# EAGLE design SparkFun_XBee3_Cat1_Smart_Modem_USB-C (EAGLE 9.6.2)
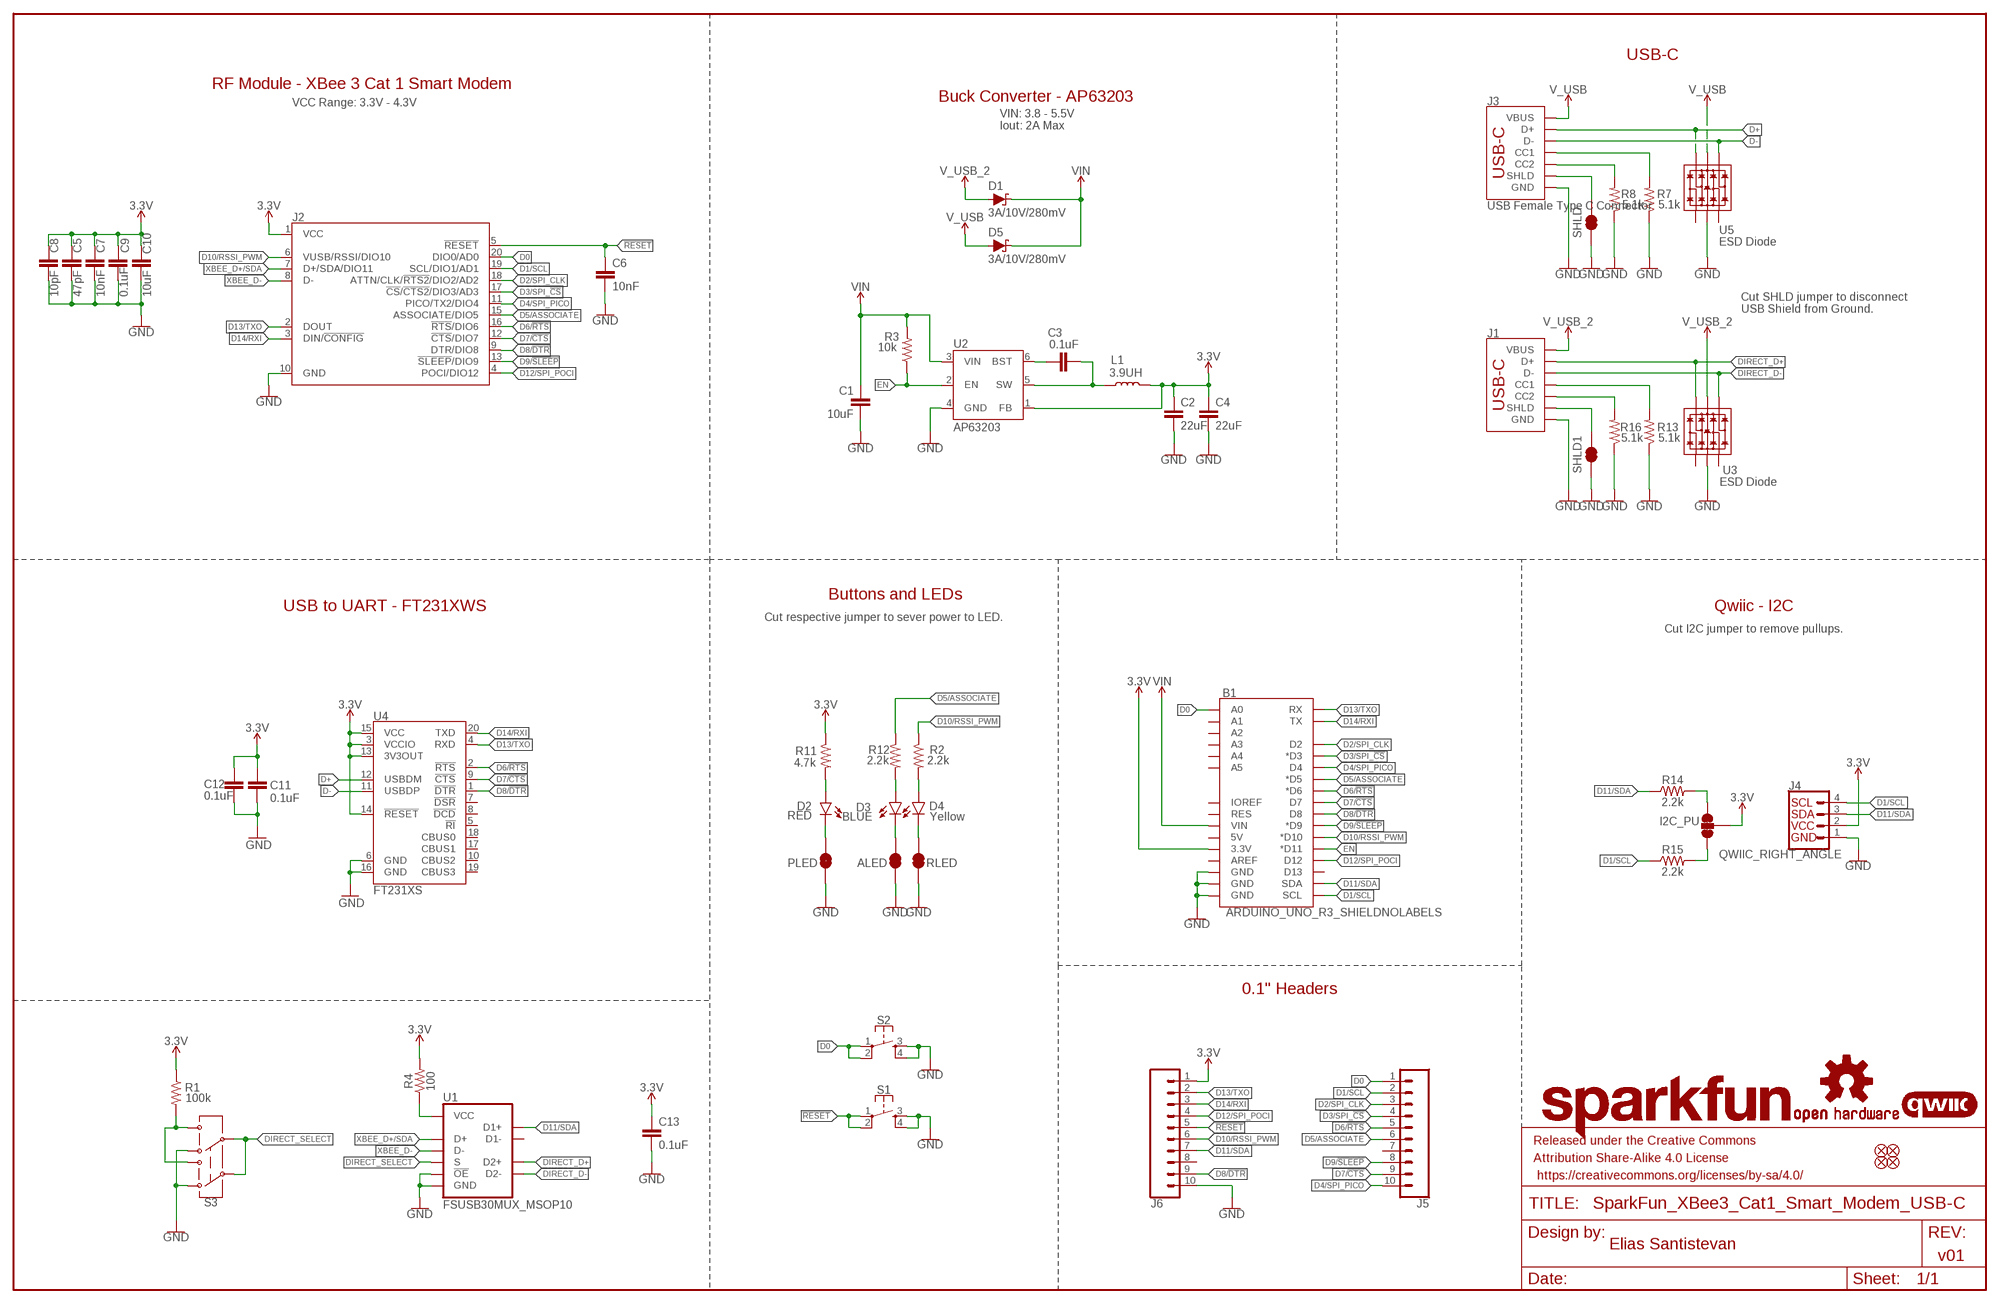
[diagram p0: schematic, sheet 1]

## Parts
ALED  JUMPER-SMT_2_NC_TRACE_SILK  [SMT-JUMPER_2_NC_TRACE_SILK]
B1  ARDUINO_UNO_R3_SHIELDNOLABELS  [UNO_R3_SHIELD_NOLABELS]
C1  10uF  10UF-1210-50V-20%  [1210]
C2  22uF  22UF-0603-6.3V-20%  [0603]
C3  0.1uF  0.1UF-0603-25V-5%  [0603]
C4  22uF  22UF-0603-6.3V-20%  [0603]
C5  47pF  47PF-0603-50V-5%  [0603]
C6  10nF  10NF-0603-50V-10%  [0603]
C7  10nF  10NF-0603-50V-10%  [0603]
C8  10pF  10PF-0603-50V-5%  [0603]
C9  0.1uF  0.1UF-0603-25V-(+80/-20%)  [0603]
C10  10uF  10UF-0603-6.3V-20%  [0603]
C11  0.1uF  0.1UF-0603-25V-(+80/-20%)  [0603]
C12  0.1uF  0.1UF-0603-25V-(+80/-20%)  [0603]
C13  0.1uF  0.1UF-0603-25V-(+80/-20%)  [0603]
D1  3A/10V/280mV  DIODE-SCHOTTKY-BAT60A  [SOD-323]
D2  RED  LED-RED_0603-KB  [LED-0603]
D3  BLUE  LED-BLUE0603  [LED-0603]
D4  Yellow  LED-YELLOW0603  [LED-0603]
D5  3A/10V/280mV  DIODE-SCHOTTKY-BAT60A  [SOD-323]
FD1  FIDUCIAL1X2  [FIDUCIAL-1X2]
FD2  FIDUCIAL1X2  [FIDUCIAL-1X2]
FD3  FIDUCIAL1X2  [FIDUCIAL-1X2]
FD4  FIDUCIAL1X2  [FIDUCIAL-1X2]
FRAME1  FRAME-LEDGER  [CREATIVE_COMMONS]
I2C_PU  JUMPER-SMT_3_2-NC_TRACE_SILK  [SMT-JUMPER_3_2-NC_TRACE_SILK]
J1  USB Female Type C Connector  USB_C_4-LAYER-ISOLATED  [USB-C-16P-4LAYER-ISOLATED]
J2  XBEE_UPDATEXBEE_SMD_SILK  [XBEE3-SMD_SILK]
J3  USB Female Type C Connector  USB_C_4-LAYER-ISOLATED  [USB-C-16P-4LAYER-ISOLATED]
J4  QWIIC_RIGHT_ANGLE  QWIIC_CONNECTORJS-1MM  [JST04_1MM_RA]
J5  CONN_10NO_SILK_PTH_FEMALE  [1X10_NO_SILK]
J6  CONN_10NO_SILK_PTH_FEMALE  [1X10_NO_SILK]
L1  3.9UH  [INDUCTOR_3.9UH]
LOGO1  SFE_LOGO_NAME.1_INCH  [SFE_LOGO_NAME_.1]
LOGO2  OSHW-LOGOS  [OSHW-LOGO-S]
LOGO3  QWIIC_LOGO_3MM  [QWIIC_3MM]
PLED  JUMPER-SMT_2_NC_TRACE_SILK  [SMT-JUMPER_2_NC_TRACE_SILK]
R1  100k  100KOHM-0603-1/10W-1%  [0603]
R2  2.2k  2.2KOHM-0603-1/10W-1%  [0603]
R3  10k  10KOHM-0603-1/10W-1%  [0603]
R4  100  100OHM-0603-1/10W-1%  [0603]
R7  5.1k  5.1KOHM5.1KOHM-0603-1/10W-1%  [0603]
R8  5.1k  5.1KOHM5.1KOHM-0603-1/10W-1%  [0603]
R11  4.7k  4.7KOHM-0603-1/10W-1%  [0603]
R12  2.2k  2.2KOHM-0603-1/10W-1%  [0603]
R13  5.1k  5.1KOHM5.1KOHM-0603-1/10W-1%  [0603]
R14  2.2k  2.2KOHM-0603-1/10W-1%  [0603]
R15  2.2k  2.2KOHM-0603-1/10W-1%  [0603]
R16  5.1k  5.1KOHM5.1KOHM-0603-1/10W-1%  [0603]
RLED  JUMPER-SMT_2_NC_TRACE_SILK  [SMT-JUMPER_2_NC_TRACE_SILK]
S1  MOMENTARY-SWITCH-SPST-2-SMD-5.2MM-TALL  [TACTILE_SWITCH_SMD_5.2MM]
S2  MOMENTARY-SWITCH-SPST-2-SMD-5.2MM-TALL  [TACTILE_SWITCH_SMD_5.2MM]
S3  SWITCH-DPDT-SMD-AYZ0202  [SWITCH_DPDT_SMD_AYZ0202]
SHLD  JUMPER-SMT_2_NC_TRACE_SILK  [SMT-JUMPER_2_NC_TRACE_SILK]
SHLD1  JUMPER-SMT_2_NC_TRACE_SILK  [SMT-JUMPER_2_NC_TRACE_SILK]
U1  FSUSB30MUX_MSOP10  [MSOP10]
U2  AP63203  [SOT23-6]
U3  ESD Diode  TVS_DIODE_ARRAY_DT1042-04SO-7  [SOT-23-6]
U4  FT231XS  [SSOP20_L]
U5  ESD Diode  TVS_DIODE_ARRAY_DT1042-04SO-7  [SOT-23-6]

## Nets
3.3V: B1.3.3V C2.1 C4.1 C5.1 C7.1 C8.1 C9.1 C10.1 C11.1 C12.1 C13.1 I2C_PU.2 J2.1(VCC) J4.2 J6.1 L1.P$2 R1.1 R4.2 R11.1 U2.1(FB) U4.3(VCCIO) U4.13(3V3OUT) U4.14(!RESET) U4.15(VCC)
!RESET!: C6.1 J2.5(!RESET!) J6.5 S1.1 S1.2
D0: B1.A0 J2.20(DIO0/AD0) J5.1 S2.1 S2.2
D1/SCL: B1.SCL J2.19(SCL/DIO1/AD1) J4.4 J5.2 R15.1
D2/SPI_CLK: B1.D2 J2.18(ATTN/CLK/!RTS2!/DIO2/AD2) J5.3
D3/SPI_!CS!: B1.D3(*D3) J2.17(!CS!/!CTS2!/DIO3/AD3) J5.4
D4/SPI_PICO: B1.D4 J2.11(PICO/TX2/DIO4) J5.10
D5/ASSOCIATE: B1.D5(*D5) J2.15(ASSOCIATE/DIO5) J5.6 R12.1
D6/!RTS!: B1.D6(*D6) J2.16(!RTS!/DIO6) J5.5 U4.2(!RTS)
D7/!CTS!: B1.D7 J2.12(!CTS!/DIO7) J5.9 U4.9(!CTS)
D8/!DTR!: B1.D8 J2.9(DTR/DIO8) J6.9 U4.1(!DTR)
D9/!SLEEP!: B1.D9(*D9) J2.13(!SLEEP!/DIO9) J5.8
D10/RSSI_PWM: B1.D10(*D10) J2.6(VUSB/RSSI/DIO10) J6.6 R2.1
D11/SDA: B1.SDA J4.3 J6.7 R14.1 U1.2(D1+)
D12/SPI_POCI: B1.D12 J2.4(POCI/DIO12) J6.4
D13/TXO: B1.RX J2.2(DOUT) J6.2 U4.4(RXD)
D14/RXI: B1.TX J2.3(DIN/!CONFIG!) J6.3 U4.20(TXD)
D+ [Diff pairs]: J3.A6(D+) J3.B6(D+) U4.12(USBDM) U5.6(IO4)
D- [Diff pairs]: J3.A7(D-) J3.B7(D-) U4.11(USBDP) U5.4(IO3)
DIRECT_D+ [Diff pairs]: J1.A6(D+) J1.B6(D+) U1.3(D2+) U3.6(IO4)
DIRECT_D- [Diff pairs]: J1.A7(D-) J1.B7(D-) U1.7(D2-) U3.4(IO3)
DIRECT_SELECT: S3.2 S3.5 U1.1(S)
EN: B1.D11(*D11) R3.1 U2.2(EN)
FIRMWARE: R1.2 S3.1 S3.4
GND: ALED.1 B1.GND@0(GND) B1.GND@1(GND) B1.GND@2(GND) C1.2 C2.2 C4.2 C5.2 C6.2 C7.2 C8.2 C9.2 C10.2 C11.2 C12.2 C13.2 J1.GND J1.GND2(GND) J2.10(GND) J3.GND J3.GND2(GND) J4.1 J6.10 PLED.1 R7.1 R8.1 R13.1 R16.1 RLED.1 S1.3 S1.4 S2.3 S2.4 S3.3 S3.6 SHLD1.1 SHLD.1 U1.5(GND) U1.9(!OE!) U2.4(GND) U3.2(VSS) U4.6(GND) U4.16(GND) U5.2(VSS)
N$1: C3.1 U2.6(BST)
N$2: D4.A R2.2
N$3: D4.C RLED.2
N$5: J3.B5(CC2) R8.2
N$6: J3.A5(CC1) R7.2
N$7: D2.A R11.2
N$8: C3.2 L1.P$1 U2.5(SW)
N$10: R4.1 U1.10(VCC)
N$11: I2C_PU.3 R14.2
N$12: D3.A R12.2
N$13: I2C_PU.1 R15.2
N$14: J1.B5(CC2) R16.2
N$15: J1.A5(CC1) R13.2
N$21: ALED.2 D3.C
N$23: D2.C PLED.2
SHLD: J3.SHLD1(SHLD) J3.SHLD2(SHLD) J3.SHLD3(SHLD) J3.SHLD4(SHLD) J3.SHLD5(SHLD) J3.SHLD6(SHLD) J3.SHLD7(SHLD) J3.SHLD8(SHLD) SHLD.2
SHLD1: J1.SHLD1(SHLD) J1.SHLD2(SHLD) J1.SHLD3(SHLD) J1.SHLD4(SHLD) J1.SHLD5(SHLD) J1.SHLD6(SHLD) J1.SHLD7(SHLD) J1.SHLD8(SHLD) SHLD1.2
V_USB: D5.A J3.VBUS1(VBUS) J3.VBUS2(VBUS) U5.5(VCC)
V_USB_2: D1.A J1.VBUS1(VBUS) J1.VBUS2(VBUS) U3.5(VCC)
VIN: B1.VIN C1.1 D1.C D5.C R3.2 U2.3(VIN)
XBEE_D+/SDA [Diff pairs]: J2.7(D+/SDA/DIO11) U1.4(D+)
XBEE_D- [Diff pairs]: J2.8(D-) U1.6(D-)
Unconnected: B1.5V B1.A1 B1.A2 B1.A3 B1.A4 B1.A5 B1.AREF B1.D13 B1.IOREF B1.RES J5.7 J6.8 U1.8(D1-) U3.1(IO1) U3.3(IO2) U4.5(!RI) U4.7(!DSR) U4.8(!DCD) U4.10(CBUS2) U4.17(CBUS1) U4.18(CBUS0) U4.19(CBUS3) U5.1(IO1) U5.3(IO2)

## Notes on the sheet
- USB-C
- RF Module - XBee 3 Cat 1 Smart Modem
- Buck Converter - AP63203
- VCC Range: 3.3V - 4.3V
- VIN: 3.8 - 5.5V
  Iout: 2A Max
- Cut SHLD jumper to disconnect
  USB Shield from Ground.
- Buttons and LEDs
- USB to UART - FT231XWS | Qwiic - I2C
- Cut respective jumper to sever power to LED.
- Cut I2C jumper to remove pullups.
- 0.1" Headers
- Elias Santistevan
- v01

## Library data of the parts
ALED PLED RLED SHLD SHLD1 = SparkFun-Jumpers:JUMPER-SMT_2_NC_TRACE: Normally closed trace jumper This jumper has a trace between two pads so it's normally closed (NC). Use a razor knife to open the connection. For best results follow the IPC guidelines for cutting traces: Cutout at least 0.063 mm (0.005 in). Remove all loose material to clean up the cut area. Seal the cut with an approved epoxy. Reapply solder to reclose the connection.
B1 = SparkFun-Boards:ARDUINO_UNO_R3_SHIELD: Arduino R3 Shield Footprint Shield form compatible with the Arduino Uno R3. SparkFun Products: MG2639 Cellular Shield <https://www.sparkfun.com/products/13120> MIDI Shield <https://www.sparkfun.com/products/12898> R3 Stackable Headers Kit <https://www.sparkfun.com/products/11417>
C1 = SparkFun-Capacitors:10UF: 10.0µF ceramic capacitors A capacitor is a passive two-terminal electrical component used to store electrical energy temporarily in an electric field.; PROD_ID: CAP-09824
C2 C4 = SparkFun-Capacitors:22UF: 22µF ceramic capacitors A capacitor is a passive two-terminal electrical component used to store electrical energy temporarily in an electric field.; PROD_ID: CAP-14464
C3 = SparkFun-Capacitors:0.1UF: 0.1µF ceramic capacitors A capacitor is a passive two-terminal electrical component used to store electrical energy temporarily in an electric field.; PROD_ID: CAP-08604
C5 = SparkFun-Capacitors:47PF: 47pF ceramic capacitors A capacitor is a passive two-terminal electrical component used to store electrical energy temporarily in an electric field.; PROD_ID: CAP-08913
C6 C7 = SparkFun-Capacitors:10NF: 0.01uF/10nF/10,000pF ceramic capacitors A capacitor is a passive two-terminal electrical component used to store electrical energy temporarily in an electric field. CAP-09321; PROD_ID: CAP-00867
C8 = SparkFun-Capacitors:10PF: 10pF ceramic capacitors A capacitor is a passive two-terminal electrical component used to store electrical energy temporarily in an electric field.; PROD_ID: CAP-11812
C9 C11-C13 = SparkFun-Capacitors:0.1UF: 0.1µF ceramic capacitors A capacitor is a passive two-terminal electrical component used to store electrical energy temporarily in an electric field.; PROD_ID: CAP-00810
C10 = SparkFun-Capacitors:10UF: 10.0µF ceramic capacitors A capacitor is a passive two-terminal electrical component used to store electrical energy temporarily in an electric field.; PROD_ID: CAP-11015
D1 D5 = SparkFun-DiscreteSemi:DIODE-SCHOTTKY: Schottky diode A Schottky diode is a semiconductor diode which has a low forward voltage drop and a very fast switching action.; PROD_ID: DIO-14072
D2 = SparkFun-LED:LED-RED: Red SMD LED Used in manufacturing of most products at SparkFun Packages: 0603 - KB - KingBright (DIO-17976) SMD 0603 package [Datasheet] <https://www.kingbrightusa.com/images/catalog/SPEC/APT1608SURCK.pdf> 0603 - (DIO-00819, has gone EOL) SMD 0603 package 0603 SMART - SMD 0603 SMART package ( more efficient and expensive)[Product Link] <http://www.osram-os.com/Graphics/XPic2/00077099_0.pdf> 1206 - SMD1206 package [Product Link] <https://www.sparkfun.com/datasheets/DevTools/LilyPad/Q150OVS4.pdff> SparkFun Products: Pro Mini 328 -5V <https://www.sparkfun.com/products/821> RedBoard <https://www.sparkfun.com/products/12757> IOIO-OTG <https://www.sparkfun.com/products/13613>; PROD_ID: DIO-17976
D3 = SparkFun-LED:LED-BLUE: Blue SMD LED Used in manufacturing of various products at SparkFun Packages: 0603 - SMD 0603 package [Product Link] <http://www.digikey.com/product-detail/en/SMLE12BC7TT86/511-1589-2-ND/1641808> 1206 - SMD1206 package [Product Link] <http://www.digikey.com/product-detail/en/lite-on-inc/LTST-C150TBKT/160-1643-1-ND/573584> SparkFun Products: ESP8266 Thing-Dev Board <https://www.sparkfun.com/products/13711> RedBoard <https://www.sparkfun.com/products/12757>; PROD_ID: DIO-08575
D4 = SparkFun-LED:LED-YELLOW: Yellow SMD LED Used in manufacturing several products at SparkFun. Packages: 0603 - SMD 0603 package[Product Link] <http://www.kingbrightusa.com/product.asp?catalog_name=LED&product_id=APT1608SYCK> 0603 -SMART - SMART SMD 0603 package (more efficient/more expensive) [Product Link] <http://www.osram-os.com/osram_os/en/products/product-catalog/led-light-emitting-diodes/smartled-0603/ly-l29k/index.jsp> LilyPad - SMD1206 package[Product Datasheet] <https://www.sparkfun.com/datasheets/DevTools/LilyPad/Q150YUS4.pdf> SparkFun Products: Blynk Board <https://www.sparkfun.com/products/13794> IOIO-OTG <https://www.sparkfun.com/products/13613> XBee Explorer Serial <https://www.sparkfun.com/products/13225>; PROD_ID: DIO-09003
FD1-FD4 = SparkFun-Aesthetics:FIDUCIAL: Fiducial Alignment Points Point-of-reference for pick-and-place machines and other optical instruments.
FRAME1 = SparkFun-Aesthetics:FRAME-LEDGER: Schematic Frame - Ledger Standard 11x14 US Ledger frame
I2C_PU = SparkFun-Jumpers:JUMPER-SMT_3_2-NC_TRACE: Normally closed trace jumper (2 of 2 connections) This jumper has a trace between all three pads so they are normally closed (NC). Use a razor knife to open the connection(s). For best results follow the IPC guidelines for cutting traces: Cutout at least 0.063 mm (0.005 in). Remove all loose material to clean up the cut area. Seal the cut with an approved epoxy. Reapply solder to reclose the connection(s).
J1 J3 = SparkFun-Connectors:USB_C: USB Type C 16Pin Connector Super Speed pins not available on the 16-pin purely SMD connector so this part is best for USB 2.0 implementations. D1 and D2 are tied together enabling D+/- no matter which way the cable is plugged into the connector. The two channel configuration pins (CC1/2) are exposed. These are normally connected to ground via 5.1k resistors but can be reconfigured for high current/high power applications. **4-LAYER BOARD WARNING!!** If designing 4-layer board, make sure to select the variant _4-LAYER-ISOLATED. The linked footprint (USB-C-16-4LAYER-ISOLATED) includes some very necessary cutout polygons in the inner layers (2 and 15). This prevents the PTH mounting shield legs on the USB connector from electrically connecting any other polygons on the inner layers (usually VCC and GND).; PROD_ID: CONN-14122
J2 = xbee_smart_modem:XBEE_UPDATE: XBee 3 Cat 1 Smart Modem; PROD_ID: WRL-17581
J4 = SparkFun-Connectors:QWIIC_CONNECTOR: SparkFun I2C Standard Qwiic Connector An SMD 1mm pitch JST connector makes it easy and quick (get it? Qwiic?) to connect I2C devices to each other. The Qwiic system <http://www.sparkfun.com/qwiic> enables fast and solderless connection between popular platforms and various sensors and actuators. We carry 200mm <https://www.sparkfun.com/products/14204>, 100mm <https://www.sparkfun.com/products/14205>, 50mm <https://www.sparkfun.com/products/14206>, and breadboard friendly <https://www.sparkfun.com/products/14207> Qwiic cables. We also offer 10 pcs strips <https://www.sparkfun.com/products/14323> the SMD connectors.; PROD_ID: CONN-13694
J5 J6 = SparkFun-Connectors:CONN_10: Multi connection point. Often used as Generic Header-pin footprint for 0.1 inch spaced/style header connections On any of the 0.1 inch spaced packages, you can populate with these: Break Away Headers - Straight <https://www.sparkfun.com/products/116> (PRT-00116) Break Away Male Headers - Right Angle <https://www.sparkfun.com/products/553> (PRT-00553) Female Headers <https://www.sparkfun.com/products/115> (PRT-00115) Break Away Headers - Machine Pin <https://www.sparkfun.com/products/117> (PRT-00117) Break Away Female Headers - Swiss Machine Pin <https://www.sparkfun.com/products/743> (PRT-00743) Arduino Stackable Header - 10 Pin <https://www.sparkfun.com/products/11376> (PRT-11376) For SCREWTERMINALS and SPRING TERMINALS visit here: Screw Terimnals on SparkFun.com <https://www.sparkfun.com/search/results?term=Screw+Terminals> (5mm/3.5mm/2.54mm spacing) This device is also useful as a general connection point to wire up your design to another part of your project. Our various solder wires solder well into these plated through hole pads. Hook-Up Wire - Assortment (Stranded, 22 AWG) <https://www.sparkfun.com/products/11375> (PRT-11375) Hook-Up Wire - Assortment (Solid Core, 22 AWG) <https://www.sparkfun.com/products/11367> (PRT-11367) View the entire wire category on our website here <https://www.sparkfun.com/categories/141> Special notes: Molex polarized connector foot print use with SKU : PRT-08231 with associated crimp pins and housings. 1MM SMD Version SKU: PRT-10208 NOTES ON THE VARIANTS LOCK and LOCK_LONGPADS... This footprint was designed to help hold the alignment of a through-hole component (i.e. 6-pin header) while soldering it into place. You may notice that each hole has been shifted either up or down by 0.005 of an inch from it's more standard position (which is a perfectly straight line). This slight alteration caused the pins (the squares in the middle) to touch the edges of the holes. Because they are alternating, it causes a "brace" to hold the component in place. 0.005 has proven to be the perfect amount of "off-center" position when using our standard breakaway headers. Although looks a little odd when you look at the bare footprint, once you have a header in there, the alteration is very hard to notice. Also,if you push a header all the way into place, it is covered up entirely on the bottom side.
L1 = SparkFun-Coils:3.9UH: Würth's Electronik 3.9uH Inductor Characteristics 3.9uH 2.4A Current Rating 2.8A Saturation Inductance Frequency: 100kHzd AEC-Q200 Certified 5mm x 5mm Package 30% tolerance; PROD_ID: NDUC-18014
LOGO1 = SparkFun-Aesthetics:SFE_LOGO_NAME: SparkFun Font Logo This is the SparkFun name logo. The logo on the schematic will always be the same size; the package variant is the height of the flame part of the logo (or the height the flame would be, if it were drawn). Default layer for the logo on the board is tSilk.
LOGO2 = SparkFun-Aesthetics:OSHW-LOGO: Open-Source Hardware (OSHW) Logo This logo indicates the piece of hardware it is found on incorporates a OSHW license and/or adheres to the definition of open source hardware found here: http://freedomdefined.org/OSHW
LOGO3 = SparkFun-Aesthetics:QWIIC_LOGO: Qwiic Logos for placement on schematic and PCB. The 5.5mm silk logo is best for placing next to Qwiic connector.
R1 = SparkFun-Resistors:100KOHM: 100kΩ resistor A resistor is a passive two-terminal electrical component that implements electrical resistance as a circuit element. Resistors act to reduce current flow, and, at the same time, act to lower voltage levels within circuits. - Wikipedia; PROD_ID: RES-07828
R2 R12 R14 R15 = SparkFun-Resistors:2.2KOHM: 2.2kΩ resistor A resistor is a passive two-terminal electrical component that implements electrical resistance as a circuit element. Resistors act to reduce current flow, and, at the same time, act to lower voltage levels within circuits. - Wikipedia; PROD_ID: RES-08272
R3 = SparkFun-Resistors:10KOHM: 10kΩ resistor A resistor is a passive two-terminal electrical component that implements electrical resistance as a circuit element. Resistors act to reduce current flow, and, at the same time, act to lower voltage levels within circuits. - Wikipedia; PROD_ID: RES-00824
R4 = SparkFun-Resistors:100OHM: 100Ω resistor A resistor is a passive two-terminal electrical component that implements electrical resistance as a circuit element. Resistors act to reduce current flow, and, at the same time, act to lower voltage levels within circuits. - Wikipedia; PROD_ID: RES-07863
R7 R8 R13 R16 = SparkFun-Resistors:5.1KOHM; PROD_ID: RES-12083
R11 = SparkFun-Resistors:4.7KOHM: 4.7kΩ resistor A resistor is a passive two-terminal electrical component that implements electrical resistance as a circuit element. Resistors act to reduce current flow, and, at the same time, act to lower voltage levels within circuits. - Wikipedia; PROD_ID: RES-07857
S1 S2 = SparkFun-Switches:MOMENTARY-SWITCH-SPST-2: Momentary Switch (Pushbutton) - SPST - Two Circuits Normally-open (NO) SPST momentary switches (buttons, pushbuttons). Schematic symbol includes two switch circuits. Variants SMD-4.6MMX2.8MM - 4.60mm x 2.80mm Tactile Momentary Button Switch - Used on SparkFun Pro Micro - RP2040 <https://www.sparkfun.com/products/17717> SMD-5.2MM - Mini Pushbutton Switch - SMD <https://www.sparkfun.com/products/8720> - Used on Arduino Pro Mini <https://www.sparkfun.com/products/11114>; PROD_ID: SWCH-14139
S3 = SparkFun-Switches:SWITCH-DPDT: Double-Pole, Double-Throw (DPDT) Switch Double-pole, double-throw switches. Variant Overview PTH-GPI-152-3013 Used on SparkFun Geiger Counter <https://www.sparkfun.com/products/11345> SMD-AY0202 Surface Mount DPDT Switch <https://www.sparkfun.com/products/597> (COM-00597) Used on e.g. LilyPad Arduino USB - ATmega32U4 Board <https://www.sparkfun.com/products/12049>; PROD_ID: SWCH-08179; SF_SKU: COM-00597
U1 = SparkFun-IC-Special-Function:FSUSB30MUX; PROD_ID: IC-15569
U2 = SparkFun-IC-Power:AP63203: Diodes Inc. AP63203 3.8V-32V input 3.3V Buck The AP63200/AP63201/AP63203/AP63205 is a 2A, synchronous buck converter with a wide input voltage range of 3.8V to 32V and fully integrates a 125mΩ high-side power MOSFET and a 68mΩ lowside power MOSFET to provide high-efficiency step-down DC/DC conversion; PROD_ID: VREG-15244
U3 U5 = SparkFun-DiscreteSemi:TVS_DIODE_ARRAY; PROD_ID: IC-13538
U4 = SparkFun-IC-Comms:FT231X: FTDI FT231X Full Speed USB to Full-handshake UART This USB2.0 Full Speed IC offers a compact bridge to full handshake UART interfaces. The device is a UART, capable of operating up to 3MBaud, with low power consumption (8mA). The FT231X includes the complete FT-X series feature set and enables USB to be added into a system design quickly and easily over a UART interface. Datasheet <http://cdn.sparkfun.com/datasheets/Components/General%20IC/DS_FT231X.pdf> SparkFun Products SparkFun RedBoard - Programmed with Arduino <https://www.sparkfun.com/products/12757> (DEV-12757) SparkFun XBee Explorer USB <https://www.sparkfun.com/products/11812> (WRL-11812) SparkFun XBee Explorer Dongle <https://www.sparkfun.com/products/11697> (WRL-11697) SparkFun Blynk Board - ESP8266 <https://www.sparkfun.com/products/13794> (WRL-13794) SparkFun ESP8266 Thing - Dev Board <https://www.sparkfun.com/products/13711> (WRL-13711) SparkFun Block for Intel® Edison - Base <https://www.sparkfun.com/products/13045> (DEV-13045) SparkFun RedStick <https://www.sparkfun.com/products/13741> (DEV-13741) SparkFun Beefy 3 - FTDI Basic Breakout <https://www.sparkfun.com/products/13746> (DEV-13746) SparkFun FT231X Breakout <https://www.sparkfun.com/products/11736> (BOB-11736); PROD_ID: IC-11524

## Net classes
1 POWER: width 0.559 mm, drill 0.305 mm
2 Diff pairs: width 0.203 mm, drill 0.305 mm, clearance 0.152 mm

## Board
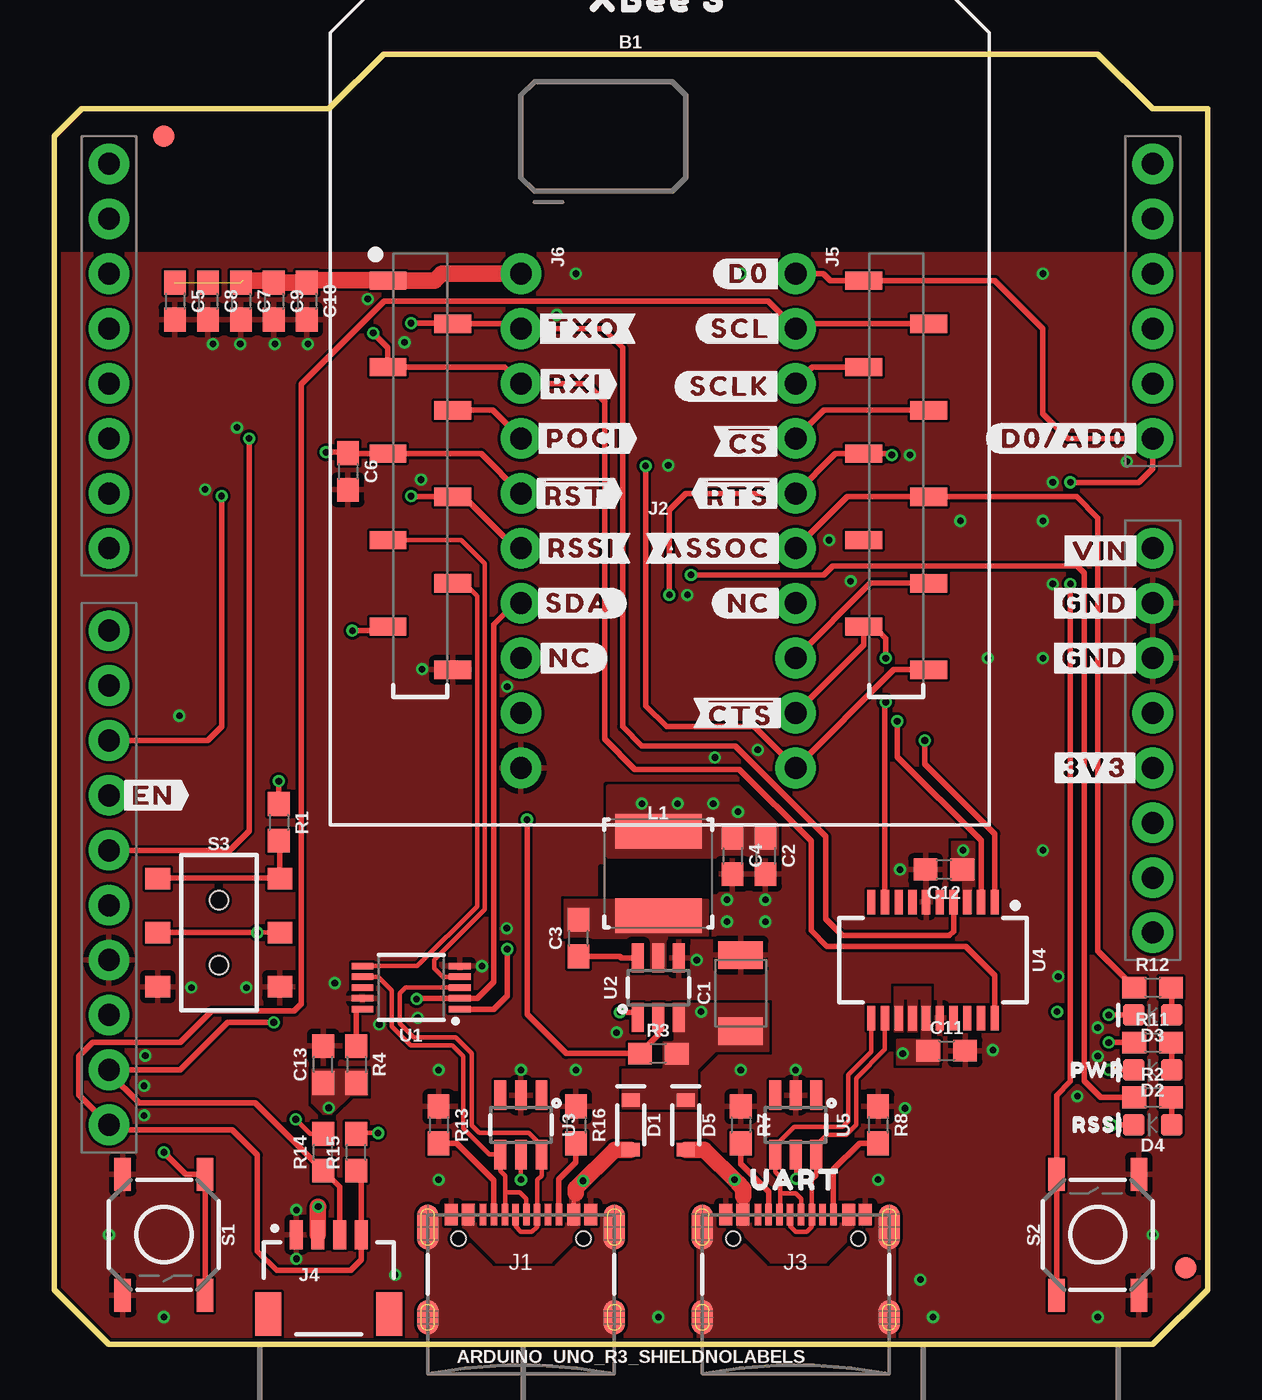
[diagram p1: board, top side]
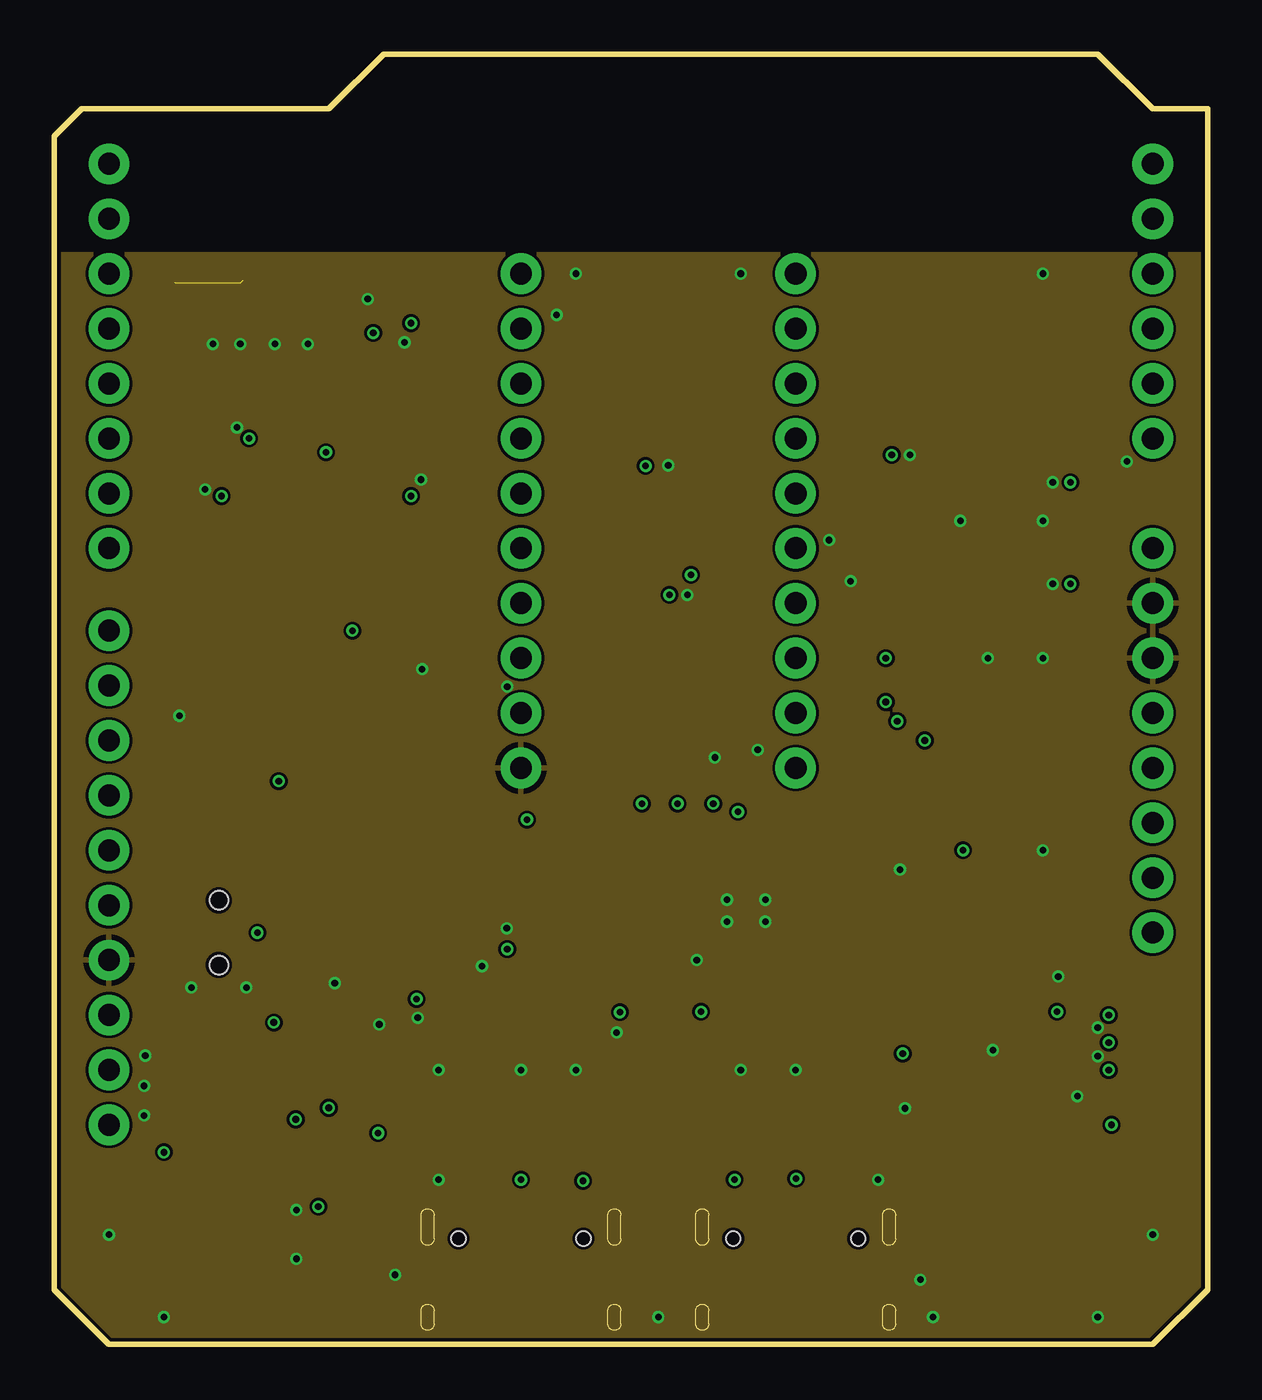
[diagram p2: board, inner layer Route2]
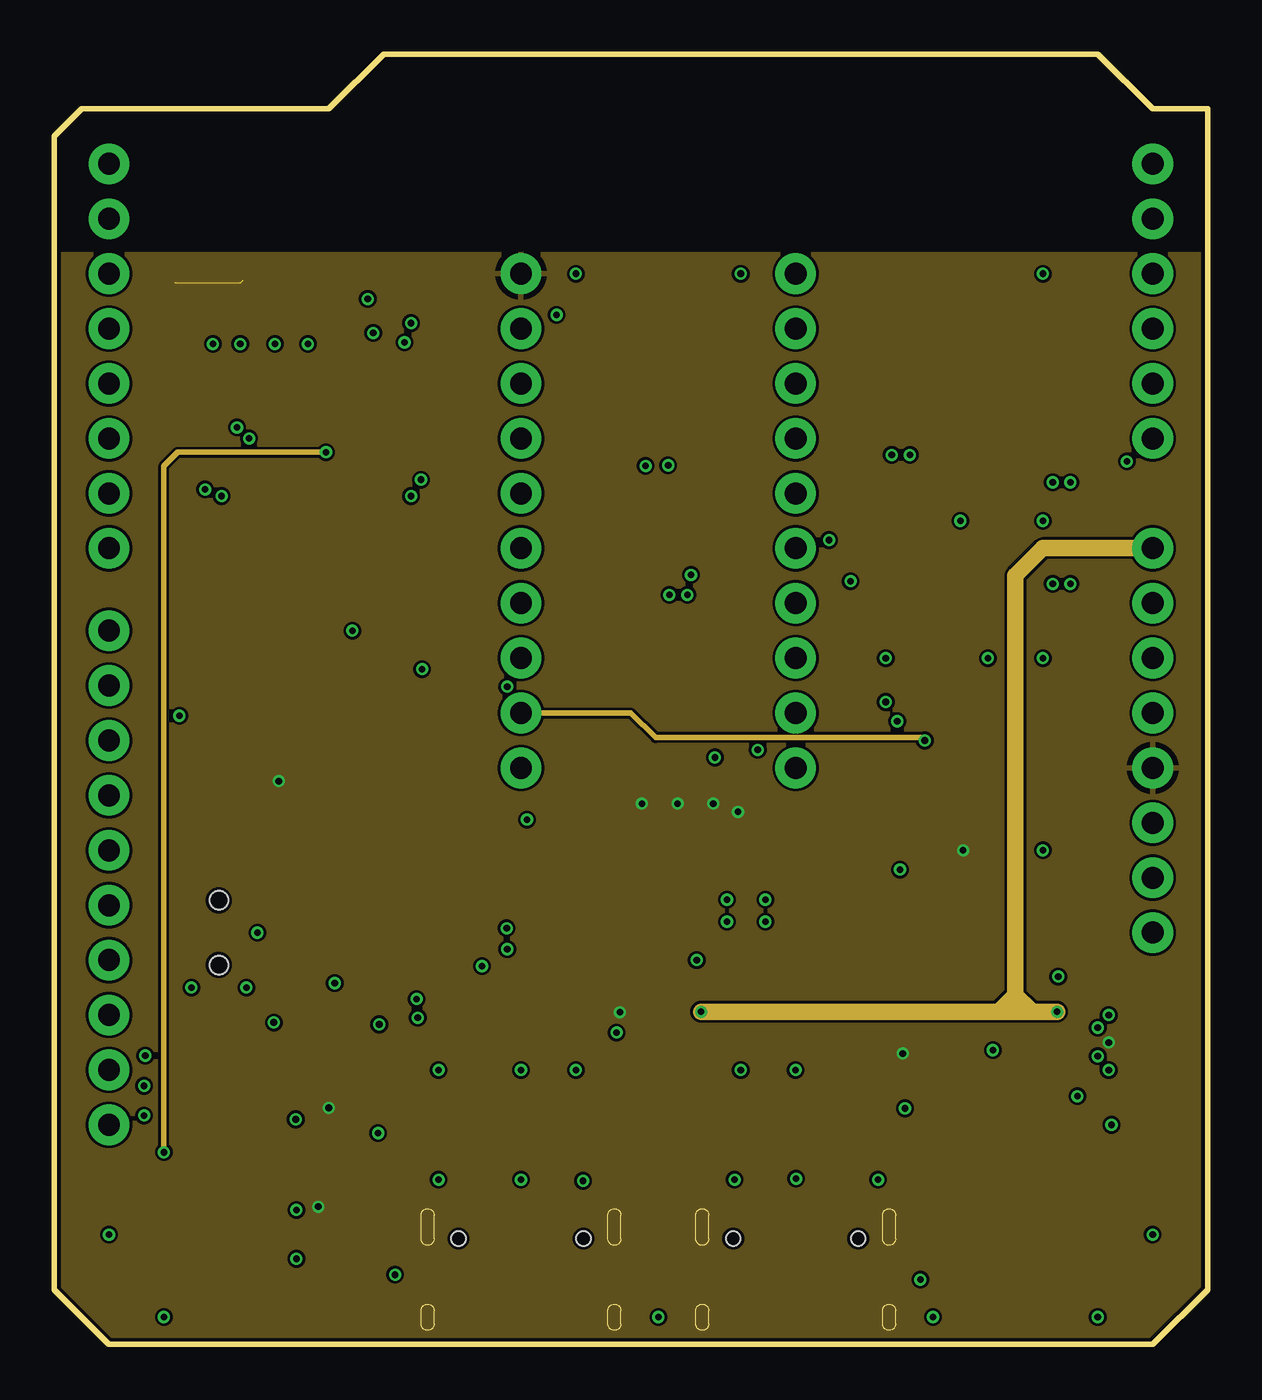
[diagram p3: board, inner layer Route15]
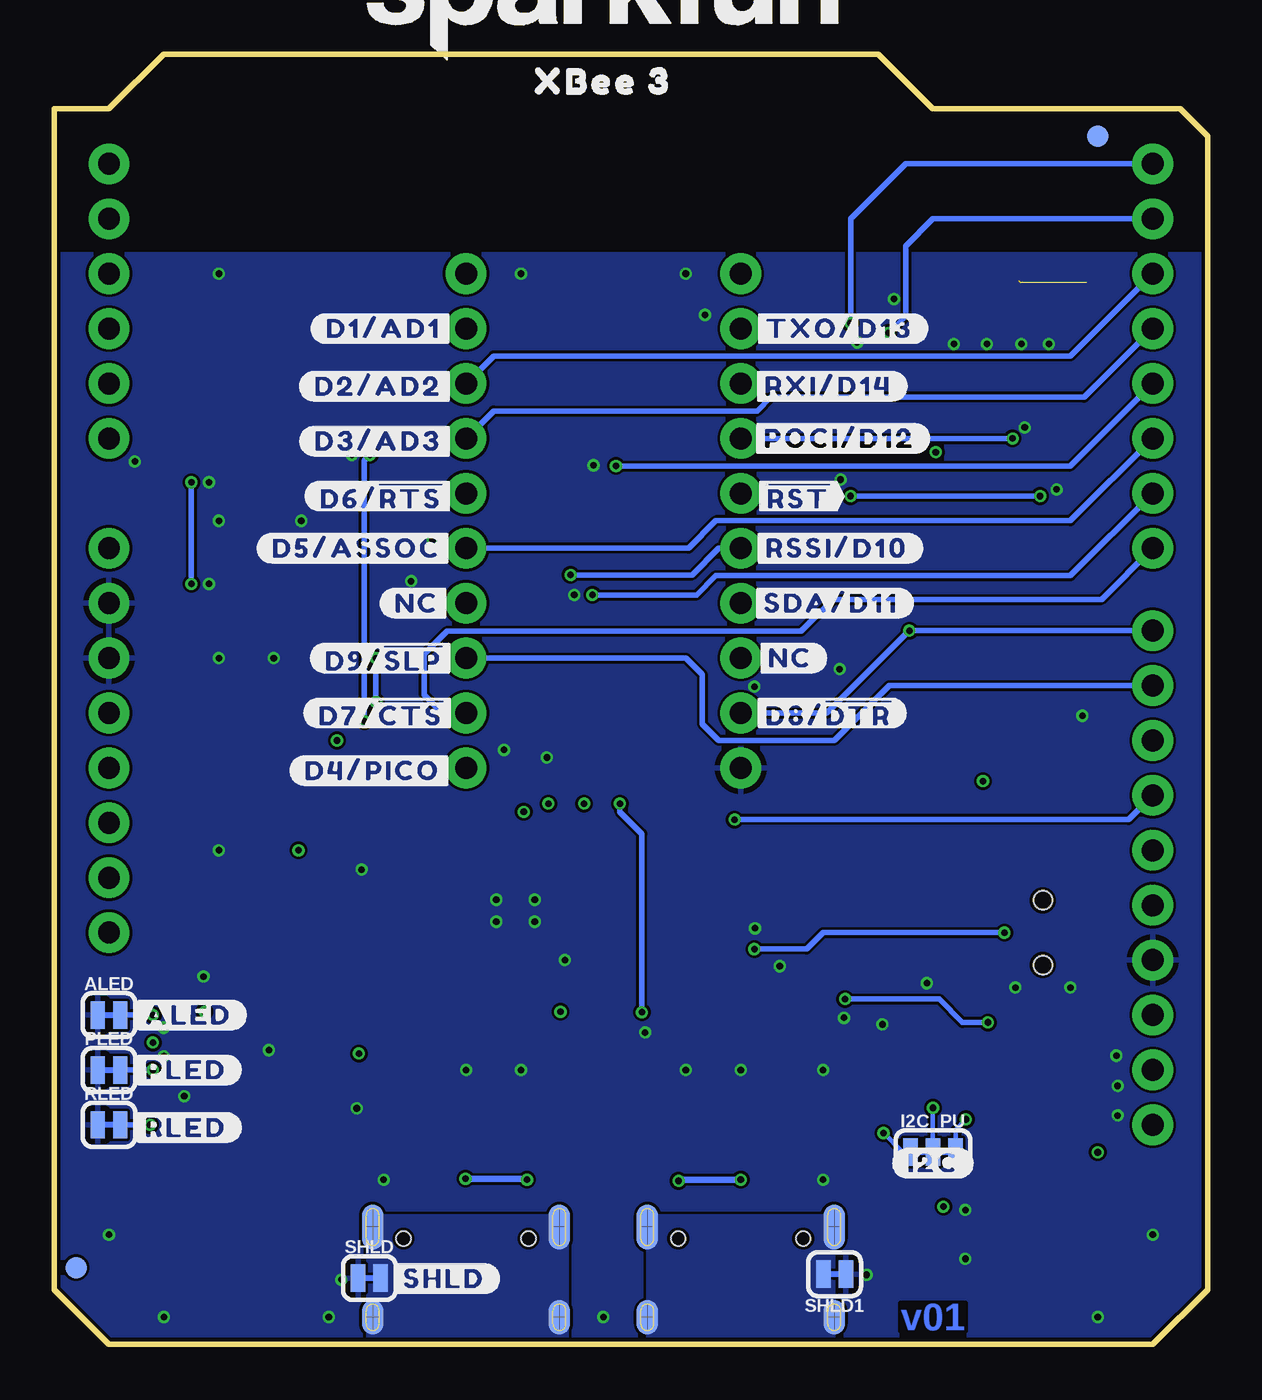
[diagram p4: board, bottom side, seen from below]

Size 53.34 x 59.69 mm. Coordinates in mm from the lower left corner, seen from the top.
Outline: 0,55.88 0,2.54 2.54,0 50.8,0 53.34,2.54 53.34,57.15 50.8,57.15 48.26,59.69 15.24,59.69 12.7,57.15 1.27,57.15 0,55.88
Copper layers (1*2*15*16): Top 0.035559375mm / dielectric 0.47751875mm / Route2 0.035559375mm / dielectric 0.47751875mm / Route15 0.035559375mm / dielectric 0.47751875mm / Bottom 0.035559375mm
Design rules "SparkFun-4-Layer-Minimum-JLCPCB": minimum track width 5mil, minimum drill 0.2mm, track to track 5mil, track to pad 5mil, pad to pad 5mil, via to via 5mil, smd to smd 5mil, copper to edge 7mil, drill to drill 7mil, minimum pad ring 5mil, minimum via ring 5mil, stop-mask expansion 2.5mil, vias tented up to drill 25mil, thermal gap 10mil
tRestrict: area 30.2,21 to 30.6,22.1; area 25.3,21 to 25.7,22.1

### Footprints (pad centres in the part's own frame; a part is rotated, then mirrored left to right if it is on the bottom)
SMT-JUMPER_2_NC_TRACE_SILK = smd 0.66 x 1.27: 1 -0.521,0; 2 0.521,0
UNO_R3_SHIELD_NOLABELS = drill 1.016 pad 1.88: 3.3V 24.13,-3.81; 5V 24.13,-1.27; A0 24.13,11.43; A1 24.13,13.97; A2 24.13,16.51; A3 24.13,19.05; A4 24.13,21.59; A5 24.13,24.13; AREF -24.13,-15.24; D2 -24.13,19.05; D3 -24.13,16.51; D4 -24.13,13.97; D5 -24.13,11.43; D6 -24.13,8.89; D7 -24.13,6.35; D8 -24.13,2.54; D9 -24.13,0; D10 -24.13,-2.54; D11 -24.13,-5.08; D12 -24.13,-7.62; D13 -24.13,-10.16; GND@0 24.13,1.27; GND@1 24.13,3.81; GND@2 -24.13,-12.7; IOREF 24.13,-8.89; NC 24.13,-11.43; RES 24.13,-6.35; RX -24.13,24.13; SCL -24.13,-20.32; SDA -24.13,-17.78; TX -24.13,21.59; VIN 24.13,6.35
1210 = smd 1.27 x 2.06: 1 -1.755,0; 2 1.755,0
0603 = smd 1.1 x 1: 1 -0.85,0; 2 0.85,0
SOD-323 = smd 0.63 x 0.83: A 1.15,0; C -1.15,0
LED-0603 = smd 1 x 1: A -0.877,0; C 0.877,0
FIDUCIAL-1X2 = smd 1 x 1: 1 0,0
SMT-JUMPER_3_2-NC_TRACE_SILK = smd 0.66 x 1.27: 1 -1.041,0; 2 0,0; 3 1.041,0
USB-C-16P-4LAYER-ISOLATED = smd 0.3 x 1: A5 -1.25,-0.34; A6 -0.25,-0.34; A7 0.25,-0.34; A8 1.25,-0.34; B5 1.75,-0.34; B6 0.75,-0.34; B7 -0.75,-0.34; B8 -1.75,-0.34 | smd 0.6 x 1: GND -3.225,-0.34; GND2 3.225,-0.34; VBUS1 -2.45,-0.34; VBUS2 2.45,-0.34 | smd 1 x 2.1: SHLD1 -4.32,-0.915; SHLD2 4.32,-0.915 | smd 1 x 2.1 bottom: SHLD3 -4.32,-0.915; SHLD4 4.32,-0.915 | smd 1 x 1.6: SHLD5 -4.32,-5.095; SHLD8 4.32,-5.095 | smd 1 x 1.6 bottom: SHLD6 -4.32,-5.095; SHLD7 4.32,-5.095 | hole 0.65: -2.89,-1.445; 2.89,-1.445
XBEE3-SMD_SILK = smd 1.7 x 0.85: 1 -12.5,11.11; 2 -9.5,9.11; 3 -12.5,7.11; 4 -9.5,5.11; 5 -12.5,3.11; 6 -9.5,1.11; 7 -12.5,-0.89; 8 -9.5,-2.89; 9 -12.5,-4.89; 10 -9.5,-6.89; 11 12.5,-6.89; 12 9.5,-4.89; 13 12.5,-2.89; 14 9.5,-0.89; 15 12.5,1.11; 16 9.5,3.11; 17 12.5,5.11; 18 9.5,7.11; 19 12.5,9.11; 20 9.5,11.11
JST04_1MM_RA = smd 0.6 x 1.35: 1 -1.5,0; 2 -0.5,0; 3 0.5,0; 4 1.5,0 | smd 1.2 x 2: NC1 2.8,-3.675; NC2 -2.8,-3.675
1X10_NO_SILK = drill 1.016 pad 1.88: 1 0,0; 2 2.54,0; 3 5.08,0; 4 7.62,0; 5 10.16,0; 6 12.7,0; 7 15.24,0; 8 17.78,0; 9 20.32,0; 10 22.86,0
INDUCTOR_3.9UH = smd 4 x 1.6: P$1 0,-2; P$2 0,1.9
TACTILE_SWITCH_SMD_5.2MM = smd 1.524 x 0.762: 1 -2.794,1.905; 2 2.794,1.905; 3 -2.794,-1.905; 4 2.794,-1.905
SWITCH_DPDT_SMD_AYZ0202 = smd 1 x 1.15: 1 -2.5,2.825; 2 0,2.825; 3 2.5,2.825; 4 -2.5,-2.825; 5 0,-2.825; 6 2.5,-2.825 | hole 0.85: 1.5,0; -1.5,0
MSOP10 = smd 1 x 0.3: 1 -2.25,1; 2 -2.25,0.5; 3 -2.25,0; 4 -2.25,-0.5; 5 -2.25,-1; 6 2.25,-1; 7 2.25,-0.5; 8 2.25,0; 9 2.25,0.5; 10 2.25,1
SOT23-6 = smd 0.55 x 1.35: 1 -0.95,-1.375; 2 0,-1.375; 3 0.95,-1.375; 4 0.95,1.375; 5 0,1.375; 6 -0.95,1.375
SOT-23-6 = smd 0.55 x 1.35: 1 -0.95,-1.375; 2 0,-1.375; 3 0.95,-1.375; 4 0.95,1.375; 5 0,1.375; 6 -0.95,1.375
SSOP20_L = smd 0.381 x 1.143: 1 -2.857,-2.68; 2 -2.223,-2.68; 3 -1.587,-2.68; 4 -0.953,-2.68; 5 -0.318,-2.68; 6 0.318,-2.68; 7 0.953,-2.68; 8 1.587,-2.68; 9 2.223,-2.68; 10 2.857,-2.68; 11 2.857,2.68; 12 2.223,2.68; 13 1.587,2.68; 14 0.953,2.68; 15 0.318,2.68; 16 -0.318,2.68; 17 -0.953,2.68; 18 -1.587,2.68; 19 -2.223,2.68; 20 -2.857,2.68

### Placement (x,y rotation side)
ALED  50.8,15.24 0 bottom
B1  26.67,30.48 0 top
C1  31.75,16.26 90 top
C2  32.89,22.61 270 top
C3  24.26,18.8 90 top
C4  31.37,22.61 270 top
C5  5.59,48.26 270 top
C6  13.59,40.39 270 top
C7  8.64,48.26 270 top
C8  7.11,48.26 270 top
C9  10.16,48.26 270 top
C10  11.68,48.26 270 top
C11  41.27,13.59 0 top
C12  41.15,21.97 180 top
C13  12.45,12.95 90 top
D1  26.67,10.16 270 top
D2  50.8,12.7 180 top
D3  50.8,15.24 180 top
D4  50.8,10.16 180 top
D5  29.21,10.16 270 top
FD1  5.08,55.88 0 top
FD2  5.08,55.88 0 bottom
FD3  52.32,3.56 0 top
FD4  52.32,3.56 0 bottom
FRAME1  -10.16,-36.83 0 top  (outside the outline)
I2C_PU  12.7,8.89 0 bottom
J1  21.59,6.35 0 top
J2  27.94,38.1 0 top
J3  34.29,6.35 0 top
J4  12.7,5.08 0 top
J5  34.29,49.53 270 top
J6  21.59,49.53 270 top
L1  27.94,21.84 0 top
LOGO1  27.56,64.26 0 top  (outside the outline)
LOGO2  67.56,20.07 0 top  (outside the outline)
LOGO3  71.5,19.76 90 top  (outside the outline)
PLED  50.8,12.7 0 bottom
R1  10.39,24.16 270 top
R2  50.8,11.43 0 top
R3  27.94,13.46 0 top
R4  13.97,12.95 270 top
R7  31.75,10.16 270 top
R8  38.1,10.16 270 top
R11  50.8,13.97 0 top
R12  50.8,16.51 0 top
R13  17.78,10.16 270 top
R14  12.45,8.89 90 top
R15  13.97,8.89 90 top
R16  24.13,10.16 270 top
RLED  50.8,10.16 0 bottom
S1  5.08,5.08 270 top
S2  48.26,5.08 90 top
S3  7.62,19.05 270 top
SHLD  38.76,3.07 0 bottom
SHLD1  17.25,3.25 180 bottom
U1  16.51,16.51 180 top
U2  27.94,16.51 0 top
U3  21.59,10.16 180 top
U4  40.64,17.78 180 top
U5  34.29,10.16 180 top
U$1  [RSSI31]  48.26,10.16 0 top
U$2  [PWR29]  48.26,12.7 0 top
U$4  [#SHLD#36]  35.31,3.05 0 bottom
U$5  [#NC#1]  19.3,31.75 0 bottom
U$6  [#D3#AD3#23]  38.35,41.78 0 bottom
U$7  [#NC#3]  36.58,34.29 0 bottom
U$8  [#D0#AD0#18]  46.74,41.91 0 top
U$9  [#NC#1]  23.88,31.75 0 top
U$10  [#NC#3]  32.13,34.29 0 top
U$11  [#D1#AD1#8]  38.1,46.99 0 bottom
U$12  [#GND#0]  48.13,31.75 0 top
U$13  [#D8##DTR##27]  17.53,29.21 0 bottom
U$14  [#RSSI#D10#17]  17.14,36.83 0 bottom
U$15  [#SDA#D11#9]  17.4,34.29 0 bottom
U$16  [##RST##15]  18.92,39.24 0 bottom
U$17  [#POCI#D12#24]  17.02,41.91 0 bottom
U$18  [#RXI#D14#15]  17.53,44.32 0 bottom
U$19  [#D2#AD2#19]  38.35,44.32 0 bottom
U$20  [#D6##RTS##25]  38.23,39.24 0 bottom
U$21  [#TXO#8]  24.51,46.99 0 top
U$22  [#TXO#D13#13]  17.02,46.99 0 bottom
U$23  [XBEE_335]  27.94,62.23 0 top
U$26  [#I2C#33]  12.7,8.38 0 bottom
U$27  [#RXI#7]  24.1,44.42 0 top
U$28  [UART34]  34.29,7.62 0 top
U$29  [#GND#0]  48.13,34.29 0 top
U$30  [#RST#30]  74.93,20.32 90 top  (outside the outline)
U$31  [##CTS##26]  31.75,29.21 0 top
U$35  [#D5#ASSOC#25]  39.37,36.83 0 bottom
U$36  [#D9##SLP##28]  38.1,31.75 0 bottom
U$37  [#D7##CTS##26]  38.23,29.21 0 bottom
U$38  [#D4#PICO#25]  38.61,26.54 0 bottom
U$40  [D03]  77.47,20.32 90 top  (outside the outline)
U$44  [#3V3#1]  48.13,26.67 0 top
U$45  [#POCI#32]  24.51,41.91 0 top
U$48  [#EN#17]  4.57,25.4 0 top
U$49  [#ALED#21]  47.12,15.24 0 bottom
U$51  [#RLED#22]  47.24,10.03 0 bottom
U$52  [#PLED#20]  47.24,12.7 0 bottom
U$53  [XBEE_335]  27.94,58.42 0 bottom
U$54  [##RST##13]  24.13,39.37 0 top
U$55  [#RSSI#16]  24.38,36.83 0 top
U$56  [#SDA#10]  24.26,34.29 0 top
U$57  [#ASSOC#28]  30.61,36.83 0 top
U$58  [##RTS##14]  31.62,39.37 0 top
U$59  [##CS##26]  32.13,41.78 0 top
U$60  [#SCLK#33]  31.24,44.32 0 top
U$61  [SFE_LOGO_FLAME_.2]  100.08,29.08 0 top  (outside the outline)
U$63  [SFE_LOGO_NAME_.2]  27.94,62.23 0 bottom
U$64  [#SCL#9]  31.75,46.99 0 top
U$65  [#D0#3]  32.13,49.53 0 top
U$66  [#VIN#4]  48.39,36.7 0 top

### Tracks (layer width: path | path; a pad name or v marks a point on that pad's centre or on a via)
3.3V  (via drill 0.3)  (3 unrouted)
  Top 0.254: v10.39,26.06 R1.1 | R11.1 v48.77,13.97 | U2.1 26.76,15.37 v26.16,15.37
  Top 0.762: 8.74,49.21 10.06,49.21 C9.1 C10.1 11.81,49.24 15.41,49.24 J2.1 17.6,49.21 17.92,49.53 J6.1 | J4.2 12.2,6.36 v12.22,6.38
  Bottom 0.203: I2C_PU.2 v12.7,10.95
  Bottom 0.254: v26.16,15.37 26.16,23.62 27.18,24.64 v27.18,25.02
  other vias: 28.83,25.02 30.48,25.02 42.04,22.86 39.24,13.46 31.62,24.64
  pour Top (isolate 0.305, no thermals): 33.4,22.61 25.65,22.61 25.65,25.78 31.62,25.78 33.4,24
  pour Route15 (isolate 0.127, rank 3): 0,0 53.34,0 53.34,50.42 0,50.42
  pour Top (no thermals): 38.99,14.1 38.99,12.95 40.89,12.95 40.89,14.1 40.51,14.1 40.51,16.51 38.86,16.51 38.86,14.48 39.24,14.48 39.24,16 39.5,16 39.5,14.48 39.88,14.48 39.88,16 40.13,16 40.13,14.1
  pour Top (no thermals): 42.04,19.94 42.04,21.46 41.53,21.46 41.53,23.24 42.8,23.24 42.8,21.21 42.42,21.21 42.42,19.94
  pour Top (no thermals): 11.94,12.7 11.94,11.18 12.45,10.67 12.83,10.67 13.72,11.56 14.48,11.56 14.48,12.7
!RESET!  (via drill 0.3)
  Top 0.254: J6.5 19.75,41.21 J2.5 13.62,41.21 C6.1 13.55,41.27 v12.57,41.27 | S1.2 S1.1 6.1,7.87 v5.08,8.89
  Route15 0.254: v5.08,8.89 5.08,40.64 5.71,41.27 v12.57,41.27
D0  (via drill 0.3)
  Top 0.254: J5.1 35.56,49.53 35.88,49.21 J2.20 43.5,49.21 45.72,46.99 45.72,43.05 46.86,41.91 B1.A0 50.8,40.51 50.16,39.88 v46.99,39.88 | S2.1 S2.2 46.35,11.53 46.99,12.17 v46.99,35.18
  Bottom 0.254: v46.99,39.88 v46.99,35.18
D1/SCL
  Top 0.254: J2.19 34.51,47.21 J5.2 33.02,48.26 15.27,48.26 11.43,44.42 11.43,15.75 11.11,15.43 7.3,15.43 5.84,13.97 1.78,13.97 1.14,13.34 1.14,11.56 B1.SCL 2.77,9.93 8.23,9.93 9.4,8.76 9.4,4.32 10.29,3.43 13.72,3.43 14.2,3.91 J4.4 14.2,7.63 13.97,7.86 R15.1
D2/SPI_CLK
  Top 0.254: J2.18 35.05,45.21 J5.3
  Bottom 0.254: B1.D2 6.35,45.72 33.02,45.72 J5.3
D3/SPI_!CS!
  Top 0.254: J2.17 35.59,43.21 J5.4
  Bottom 0.254: B1.D3 5.71,43.81 20.19,43.81 20.83,43.18 33.02,43.18 J5.4
D4/SPI_PICO  (via drill 0.3)
  Top 0.254: J2.11 38.83,31.21 J5.10 32.38,28.57 28.32,28.57 27.36,29.54 v27.36,40.64
  Bottom 0.254: v27.36,40.64 6.35,40.64 B1.D4
D5/ASSOCIATE
  Top 0.254: J5.6 36.67,39.21 J2.15 47.28,39.21 48.26,38.23 48.26,18.2 R12.1
  Bottom 0.254: B1.D5 6.35,38.1 22.73,38.1 24,36.83 J5.6
D6/!RTS!  (via drill 0.3)
  Top 0.254: v38.73,41.15 38.67,41.21 J2.16 36.13,41.21 J5.5 29.21,39.37 28.45,38.61 v28.45,34.67 | v38.99,28.83 38.99,27.18 42.86,23.3 U4.2
  Bottom 0.254: v28.45,34.67 23.62,34.67 22.73,35.56 6.35,35.56 B1.D6 | v38.99,28.83 38.99,40.89 v38.73,41.15
D7/!CTS!  (via drill 0.3)
  Top 0.254: J5.9 36.2,31.11 37.44,32.36 37.44,33.02 | 37.44,33.02 J2.12 | U4.9 38.42,29.68 v38.46,29.72 | v38.46,31.75 38.46,32.66 38.1,33.02 37.44,33.02
  Bottom 0.254: J5.9 35.38,29.21 36.22,30.05 36.22,31.93 35.15,32.99 18.8,32.99 17.32,34.47 4.9,34.47 B1.D7 | v38.46,29.72 v38.46,31.75
D8/!DTR!  (via drill 0.3)
  Top 0.254: v13.79,33.02 15.44,33.02 J2.9 | U4.1 43.5,23.62 40.26,26.86 v40.26,27.94
  Route15 0.254: J6.9 26.67,29.21 27.81,28.07 40.13,28.07 v40.26,27.94
  Bottom 0.254: J6.9 17.6,29.21 v13.79,33.02 B1.D8
D9/!SLEEP!
  Top 0.254: J2.13 37.75,35.21 J5.8
  Bottom 0.254: B1.D9 14.73,30.48 17.27,27.94 22.61,27.94 23.37,28.7 23.37,30.99 24.13,31.75 J5.8
D10/RSSI_PWM  (via drill 0.3)
  Top 0.254: J6.6 21.33,36.83 18.95,39.21 J2.6 16.54,39.21 v16.51,39.24 | R2.1 48.39,11.43 47.62,12.19 47.62,35.69 47.31,36.01 36.01,36.01 35.6,35.6 v29.45,35.6 | v7.75,39.24 7.75,28.57 7.11,27.94 B1.D10
  Bottom 0.254: v29.45,35.6 23.84,35.6 22.61,36.83 J6.6 | v16.51,39.24 v7.75,39.24
D11/SDA  (via drill 0.3)
  Top 0.254: v16.76,15.98 16.8,16.01 U1.2 19.56,16.01 20.32,16.77 20.32,33.3 21.31,34.29 J6.7 | J4.3 13.2,7.29 R14.1 9.31,11.18 3.94,11.18 2.54,12.57 B1.SDA 5.84,12.7 8.04,14.9 v10.16,14.9
  Bottom 0.254: v16.76,15.98 12.42,15.98 11.34,14.9 v10.16,14.9
D12/SPI_POCI  (via drill 0.3)
  Top 0.254: J6.4 20.29,43.21 J2.4 | v9.02,41.91 9.02,23.75 8.13,22.86 B1.D12
  Bottom 0.254: J6.4 v9.02,41.91
D13/TXO  (via drill 0.3)
  Top 0.203: J2.2 18.41,47.24
  Top 0.254: 18.67,46.99 J2.2 | J2.2 21.37,47.21 J6.2 25.4,46.99 26.29,46.1 26.29,28.57 27.18,27.69 31.5,27.69 35.69,23.5 35.69,19.68 36.45,18.92 41.4,18.92 41.59,19.11 U4.4 | v16.51,47.24 18.41,47.24 J2.2
  Bottom 0.254: v16.51,47.24 16.51,52.07 13.97,54.61 B1.RX
D14/RXI  (via drill 0.3)
  Top 0.254: v14.76,46.79 15.44,46.1 J2.3 20.83,45.21 J6.3 24.64,44.45 25.46,43.62 25.46,28 26.86,26.61 31.69,26.61 35,23.29 35,19.15 35.74,18.41 42.16,18.41 43.5,17.08 U4.20
  Bottom 0.254: v14.76,46.79 13.97,47.57 13.97,50.8 12.7,52.07 B1.TX
D+
  Top 0.203: J3.A6 34.04,5.46 34.29,5.21 34.8,5.21 35.04,5.45 J3.B6 35.04,7.61 35.24,7.81 U5.6 35.24,9.21 35.74,9.7 36.63,9.7 37.08,10.16 37.08,12.32 38.42,13.65 U4.12
D-
  Top 0.203: 33.57,6.99 33.57,7.76 33.34,7.99 U5.4 33.34,9.19 34.21,10.06 36.47,10.06 36.73,10.31 36.73,12.47 37.78,13.53 U4.11 | 33.57,6.99 33.57,6.04 J3.B7 | 33.57,6.99 34.29,6.99 34.54,6.74 J3.A7
DIRECT_D+
  Top 0.203: J1.A6 21.34,5.46 21.59,5.21 22.1,5.21 22.34,5.45 J1.B6 22.34,7.61 22.54,7.81 U3.6 22.54,9.19 21.95,9.78 19.66,9.78 19.3,10.13 19.3,13.46 18.57,14.2 16.64,14.2 15.98,14.86 15.98,16.23 16.26,16.51 U1.3
DIRECT_D-
  Top 0.203: 20.87,7.04 20.87,6.04 J1.B7 | 20.87,7.04 20.87,7.79 20.64,8.02 U3.4 20.13,8.79 18.92,9.99 18.92,13.34 18.41,13.84 16.48,13.84 15.62,14.71 15.62,16.38 14.99,17.01 U1.7 | J1.A7 21.84,6.74 21.54,7.04 20.87,7.04
DIRECT_SELECT  (via drill 0.3)
  Top 0.203: 10.39,19 10.34,19.05 v9.4,19.05
  Top 0.254: 10.39,19 S3.2 | U1.1 20.34,15.51 20.95,16.13 v20.95,18.29 | S3.5 v9.4,19.05
  Bottom 0.254: v20.95,18.29 18.54,18.29 17.78,19.05 v9.4,19.05
EN  (via drill 0.3)
  Top 0.254: U2.2 27.94,14.31 R3.1 23.67,13.46 21.87,15.27 v21.87,24.28
  Bottom 0.254: v21.87,24.28 3.66,24.28 B1.D11 | v21.87,24.28
FIRMWARE
  Top 0.203: S3.4 4.83,21.59
  Top 0.254: S3.4 4.89,21.64 | 10.4,21.59 S3.1 10.45,21.59 | 10.45,21.59 10.45,23.25 R1.2 | 4.83,21.59 10.45,21.59
GND  (via drill 0.3)
  other vias: 31.11,19.56 32.89,19.56 17.02,31.24 29.72,17.78 19.79,17.5 43.41,13.61 46.43,17.02 8.61,46.28 10.21,46.28 11.73,46.28 15.77,3.23 40.06,3 11.2,3.96 11.2,6.22 39.34,10.92 46.18,35.18 46.18,39.88 39.57,41.15 28.4,40.67 29.29,34.67 16.97,40.01 8.46,42.42 6.99,39.55 45.72,31.75 45.72,38.1 41.91,38.1 36.83,35.31 23.24,47.62 16.21,46.35 5.79,29.08 45.72,22.86 43.18,31.75 24.13,49.53 31.75,49.53 45.72,49.53 48.26,1.27 40.64,1.27 27.94,1.27 5.08,1.27 30.56,27.15 32.54,27.51 26.01,14.43 20.93,19.25 16.81,15.11 20.95,30.43 35.84,37.21 49.61,40.84 47.32,11.48 31.75,12.7 24.13,12.7 21.59,12.7 34.29,12.7 17.78,12.7 4.17,11.96 4.22,13.36 2.54,5.08 8.89,16.51 6.35,16.51 17.78,7.62 38.1,7.62 4.17,10.59 50.8,5.08 48.26,14.66 48.26,13.34 14.5,48.36 15.04,14.81 12.98,16.71 7.34,46.28 39.12,21.97 31.11,20.57 32.89,20.57
  pour Top (isolate 0.127, rank 3): 0,0 53.34,0 53.34,50.42 0,50.42
  pour Bottom (isolate 0.127, rank 3): 0,0 53.34,0 53.34,50.42 0,50.42
  pour Route2 (isolate 0.127, rank 3): 0,0 53.34,0 53.34,50.42 0,50.42
N$1
  Top 0.254: U2.6 26.23,17.89 26.17,17.95 C3.1
N$2
  Top 0.254: D4.A 51.68,11.4 R2.2
N$3  (via drill 0.3)
  Top 0.254: D4.C v48.9,10.16
  Bottom 0.254: v48.9,10.16 RLED.2
N$5
  Top 0.254: J3.B5 36.04,8.1 37.25,9.31 R8.2
N$6
  Top 0.254: J3.A5 33.04,7.06 31.75,8.35 R7.2
N$7
  Top 0.254: D2.A 51.68,13.94 R11.2
N$8
  pour Top (isolate 0.305, no thermals): 28.32,17.27 28.32,18.92 30.23,18.92 30.23,20.57 23.62,20.57 23.62,18.8 27.56,18.8 27.56,17.27
N$10
  Top 0.254: U1.10 14.01,15.51 13.97,15.47 R4.1
N$11  (via drill 0.3)
  Top 0.203: R14.2 11.85,9.74 v11.18,10.41
  Bottom 0.203: I2C_PU.3 11.66,9.93 v11.18,10.41
N$12
  Top 0.254: D3.A 51.68,16.48 R12.2
N$13  (via drill 0.3)
  Top 0.203: v14.99,9.78 14.01,9.78 R15.2
  Bottom 0.203: I2C_PU.1 14.1,8.89 v14.99,9.78
N$14
  Top 0.254: J1.B5 23.34,7.63 24.13,8.42 R16.2
N$15
  Top 0.254: J1.A5 20.34,7.6 18.63,9.31 R13.2
N$21  (via drill 0.3)
  Top 0.254: D3.C v48.77,15.24
  Bottom 0.254: v48.77,15.24 ALED.2
N$23  (via drill 0.3)
  Top 0.254: D2.C v48.77,12.7
  Bottom 0.254: v48.77,12.7 PLED.2
SHLD  (1 unrouted)
  pour Top (rank 2, no thermals): 29.77,5.97 38.86,5.97 38.86,0 29.77,0
  pour Bottom (rank 2, no thermals): 38.86,5.97 29.59,5.97 29.59,0 38.86,0
SHLD1  (1 unrouted)
  pour Top (rank 2, no thermals): 17.27,5.97 25.91,5.97 25.91,0 17.27,0
  pour Bottom (rank 2, no thermals): 25.91,5.97 17.27,5.97 17.27,0 25.91,0
V_USB  (via drill 0.3)
  Top 0.203: U5.5 34.31,8.76 v34.31,7.67 | 31.6,7.47 31.84,7.24 J3.VBUS1 31.84,7.25 v31.47,7.62
  Top 0.762: 31.87,6.86 31.87,7.2 31.6,7.47 30.07,9.01 D5.A
  Bottom 0.203: 31.52,7.67 v31.47,7.62
  Bottom 0.305: v34.31,7.67 31.52,7.67
  pour Top (no thermals): 31.62,7.11 31.62,5.33 33.15,3.81 35.69,3.81 36.96,5.08 36.96,6.48 36.58,6.48 36.58,5.71 36.45,5.59 32.13,5.59 32.13,7.11
V_USB_2  (via drill 0.3)
  Top 0.203: U3.5 v21.59,7.62 | 24.04,7.13 J1.VBUS2 24.04,7.08 | v24.46,7.57 24.04,7.15 24.04,7.08 | 24.13,6.99 24.04,7.08
  Top 0.762: D1.A 25.92,9.01 24.13,7.22 24.13,6.99
  Bottom 0.203: 24.41,7.62 v24.46,7.57
  Bottom 0.305: v21.59,7.62 24.41,7.62
  pour Top (no thermals): 18.92,6.48 18.92,5.33 20.45,3.81 22.99,3.81 24.26,5.08 24.26,6.99 23.88,6.99 23.88,5.71 23.75,5.59 19.43,5.59 19.43,6.48
VIN  (via drill 0.3)
  Route15 0.762: B1.VIN 45.72,36.83 44.45,35.56 44.45,16.18 | 44.45,16.18 43.66,15.39 | 43.66,15.39 v29.92,15.39 | v46.38,15.39 45.09,15.39 | 44.45,16.18 45.16,15.47 45.09,15.39 | 45.09,15.39 43.66,15.39
  pour Top (no thermals): 26.29,10.92 29.72,10.92 29.72,12.7 30.61,13.59 33.02,13.59 33.02,15.75 28.7,15.75 28.7,14.1 28.57,13.97 28.19,13.97 28.19,12.83 28.07,12.7 26.29,12.7
XBEE_D+/SDA
  Top 0.203: U1.4 17.97,17.01 17.58,17.4 17.58,17.78 19.91,20.12 19.91,36.12 18.82,37.21 J2.7
XBEE_D-
  Top 0.203: U1.6 16.8,17.51 19.56,20.27 19.56,34.62 18.97,35.21 J2.8

### Text on the board
Bottom: v01
tDocu: Elias Santistevan